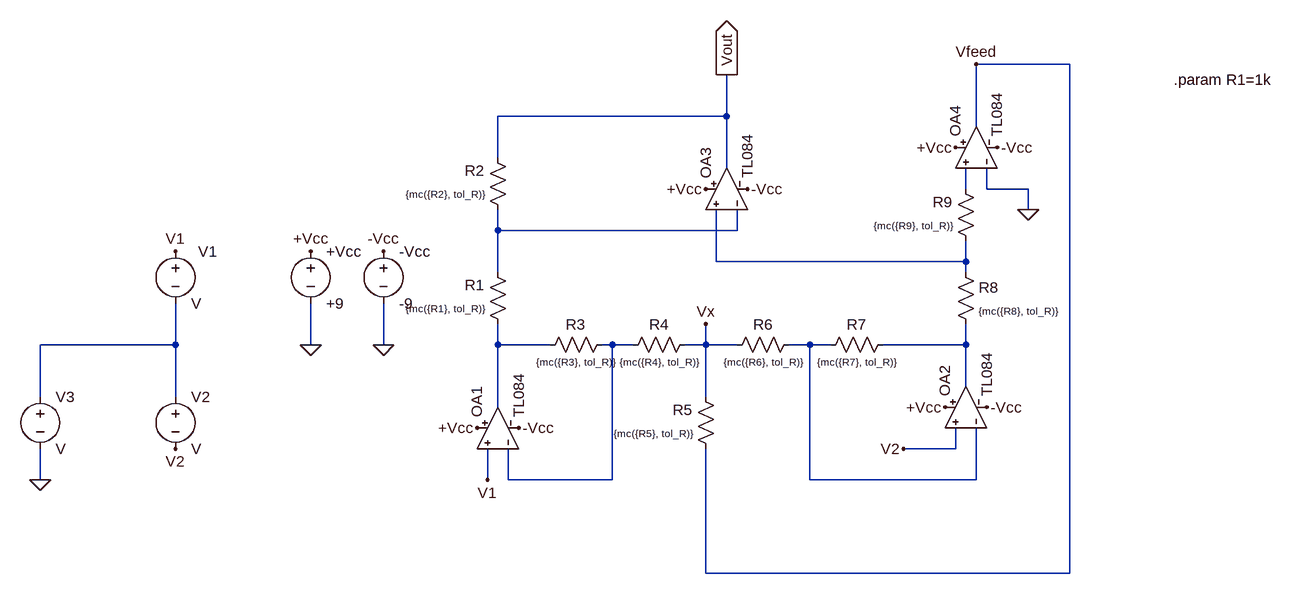
[diagram p0: schematic Circuito.asc]
Circuito.asc, the LTspice schematic file:
Version 4
SHEET 1 988 800
WIRE 656 -32 512 -32
WIRE 128 48 128 -16
WIRE 128 48 -224 48
WIRE 512 64 512 -32
WIRE -224 112 -224 48
WIRE 128 128 128 48
WIRE 496 160 496 128
WIRE 528 160 528 128
WIRE 592 160 528 160
WIRE 592 192 592 160
WIRE -224 224 -224 192
WIRE 144 224 144 192
WIRE 144 224 -224 224
WIRE 112 272 112 192
WIRE 496 272 496 240
WIRE 496 272 112 272
WIRE -224 288 -224 224
WIRE 496 288 496 272
WIRE -720 400 -720 336
WIRE -720 400 -928 400
WIRE -512 400 -512 336
WIRE -400 400 -400 336
WIRE -224 400 -224 368
WIRE -144 400 -224 400
WIRE -48 400 -64 400
WIRE -16 400 -48 400
WIRE 96 400 96 368
WIRE 96 400 64 400
WIRE 144 400 96 400
WIRE 256 400 224 400
WIRE 288 400 256 400
WIRE 496 400 496 368
WIRE 496 400 368 400
WIRE 496 464 496 400
WIRE -928 480 -928 400
WIRE -720 480 -720 400
WIRE 96 480 96 400
WIRE -224 496 -224 400
WIRE 480 560 480 528
WIRE 480 560 400 560
WIRE -928 608 -928 560
WIRE -240 608 -240 560
WIRE -208 608 -208 560
WIRE -48 608 -48 400
WIRE -48 608 -208 608
WIRE 256 608 256 400
WIRE 512 608 512 528
WIRE 512 608 256 608
WIRE 96 752 96 560
WIRE 656 752 656 -32
WIRE 656 752 96 752
FLAG 592 192 0
FLAG 128 -16 Vout
IOPIN 128 -16 Out
FLAG -240 608 V1
FLAG 400 560 V2
FLAG 96 368 Vx
FLAG 512 -32 Vfeed
FLAG -400 256 -Vcc
FLAG -512 256 +Vcc
FLAG -400 400 0
FLAG -512 400 0
FLAG -256 528 +Vcc
FLAG 464 496 +Vcc
FLAG 480 96 +Vcc
FLAG 96 160 +Vcc
FLAG -192 528 -Vcc
FLAG 160 160 -Vcc
FLAG 544 96 -Vcc
FLAG 528 496 -Vcc
FLAG -928 608 0
FLAG -720 256 V1
FLAG -720 560 V2
SYMBOL res -208 384 R180
WINDOW 0 36 76 Left 2
WINDOW 3 36 40 Left 1
SYMATTR InstName R1
SYMATTR Value {mc({R1}, tol_R)}
SYMBOL res -208 208 R180
WINDOW 0 36 76 Left 2
WINDOW 3 36 40 Left 1
SYMATTR InstName R2
SYMATTR Value {mc({R2}, tol_R)}
SYMBOL res -48 384 R90
WINDOW 0 0 56 VBottom 2
WINDOW 3 32 56 VTop 1
SYMATTR InstName R3
SYMATTR Value {mc({R3}, tol_R)}
SYMBOL res 80 384 R90
WINDOW 0 0 56 VBottom 2
WINDOW 3 32 56 VTop 1
SYMATTR InstName R4
SYMATTR Value {mc({R4}, tol_R)}
SYMBOL res 112 576 R180
WINDOW 0 36 76 Left 2
WINDOW 3 36 40 Left 1
SYMATTR InstName R5
SYMATTR Value {mc({R5}, tol_R)}
SYMBOL res 128 416 R270
WINDOW 0 32 56 VTop 2
WINDOW 3 0 56 VBottom 1
SYMATTR InstName R6
SYMATTR Value {mc({R6}, tol_R)}
SYMBOL res 272 416 R270
WINDOW 0 32 56 VTop 2
WINDOW 3 0 56 VBottom 1
SYMATTR InstName R7
SYMATTR Value {mc({R7}, tol_R)}
SYMBOL res 480 272 R0
WINDOW 3 36 76 Left 1
SYMATTR Value {mc({R8}, tol_R)}
SYMATTR InstName R8
SYMBOL res 512 256 R180
WINDOW 0 36 76 Left 2
WINDOW 3 36 40 Left 1
SYMATTR InstName R9
SYMATTR Value {mc({R9}, tol_R)}
SYMBOL voltage -400 240 R0
SYMATTR InstName -Vcc
SYMATTR Value -9
SYMBOL voltage -512 240 R0
SYMATTR InstName +Vcc
SYMATTR Value +9
SYMBOL voltage -720 240 R0
WINDOW 0 35 16 Left 2
SYMATTR InstName V1
SYMBOL voltage -720 464 R0
SYMATTR InstName V2
SYMBOL voltage -928 464 R0
SYMATTR InstName V3
SYMBOL FACUsym\\TL084 -224 528 R270
SYMATTR InstName OA1
SYMBOL FACUsym\\TL084 496 496 R270
SYMATTR InstName OA2
SYMBOL FACUsym\\TL084 512 96 R270
SYMATTR InstName OA4
SYMBOL FACUsym\\TL084 128 160 R270
SYMATTR InstName OA3
TEXT 816 -8 Left 2 !.param R1=1k

The netlist it stands for:
* Circuito.asc
R1 N005 N002 {mc({R1}, tol_R)}
R2 N002 Vout {mc({R2}, tol_R)}
R3 N006 N005 {mc({R3}, tol_R)}
R4 Vx N006 {mc({R4}, tol_R)}
R5 Vfeed Vx {mc({R5}, tol_R)}
R6 Vx N007 {mc({R6}, tol_R)}
R7 N007 N008 {mc({R7}, tol_R)}
R8 N003 N008 {mc({R8}, tol_R)}
R9 N003 N001 {mc({R9}, tol_R)}
V§-Vcc -Vcc 0 -9
V§+Vcc +Vcc 0 +9
V1 V1 N004 V
V2 N004 V2 V
V3 N004 0 V
XOA1 V1 N006 +Vcc -Vcc N005 TL084 TL084  ; pins In+ In- V+ V- OUT
XOA2 V2 N007 +Vcc -Vcc N008 TL084 TL084  ; pins In+ In- V+ V- OUT
XOA4 N001 0 +Vcc -Vcc Vfeed TL084 TL084  ; pins In+ In- V+ V- OUT
XOA3 N003 N002 +Vcc -Vcc Vout TL084 TL084  ; pins In+ In- V+ V- OUT
.param R1=1k
.lib FACUsub/TL084.lib
.backanno
.end